# Altium schematic sheet Copy of USB.SchDoc: USB
size A4; DocumentNumber: MB1137; Revision: B-01; SheetNumber: 4; SheetTotal: 6; Project: NUCLEO-XXXXZX
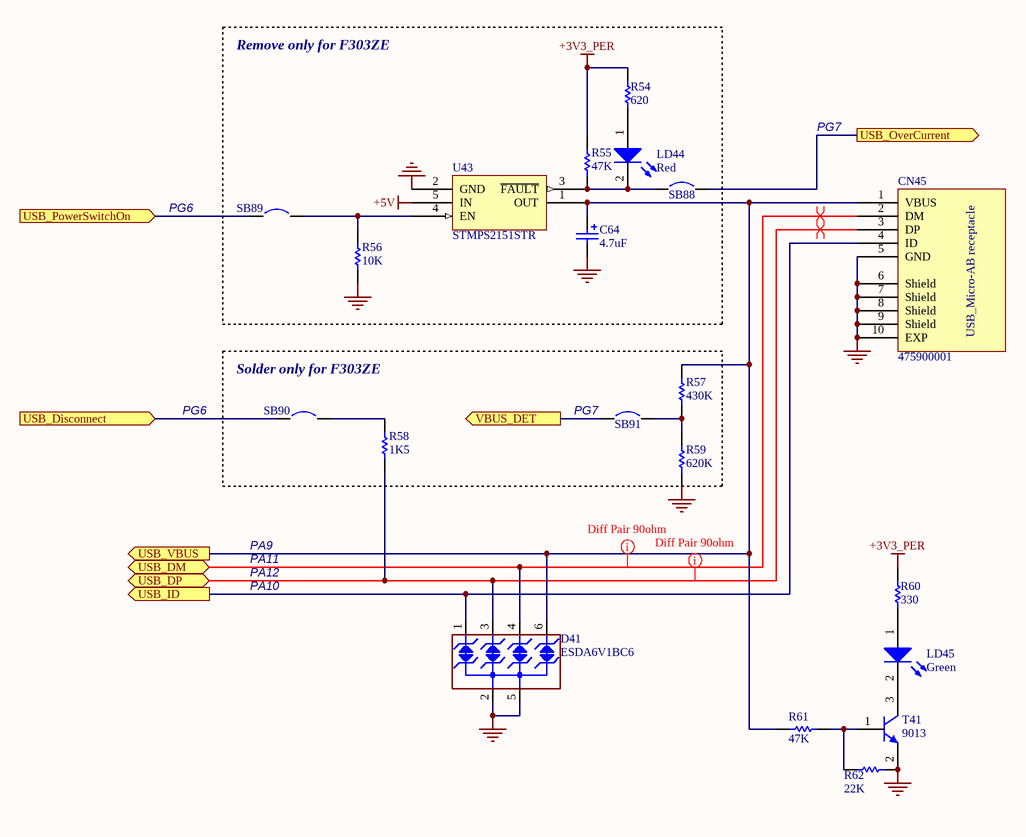
[diagram p0: Copy of USB.SchDoc]

## Parts
C64  4.7uF  [TAN-A]
CN45  475900001  [MOLEX_47590001]
D41  ESDA6V1BC6  [SOT23-6L]
LD44  Red  [0603D-R]
LD45  Green  [0603D-G]
R54  620  [0603R]
R55  47K  [0603R]
R56  10K  [0603R]
R57  430K  [0603R]
R58  1K5  [0603R]
R59  620K  [0603R]
R60  330  [0603R]
R61  47K  [0603R]
R62  22K  [0603R]
SB88  Circuit Breaker  [SB_0603]  (value not drawn)
SB89  Circuit Breaker  [SB_0603]  (value not drawn)
SB90  Circuit Breaker  [SB_0603]  (value not drawn)
SB91  Circuit Breaker  [SB_0603]  (value not drawn)
T41  9013  [SOT-23]
U43  STMPS2151STR  [SOT-23-5L]

## Blocks framed on the sheet
Remove only for F303ZE: C64 LD44 R54-R56 SB88 SB89 U43
Solder only for F303ZE: R57-R59 SB90 SB91

## Ports
USB_Disconnect (in), USB_DM (bidir), USB_DP (bidir), USB_ID (out), USB_OverCurrent (out), USB_PowerSwitchOn (in), USB_VBUS (out), VBUS_DET (out)

## Nets
+3V3_PER: R54.2 R55.1 R60.2
+5V: U43.5(IN)
GND: C64.2 CN45.5(GND) CN45.6(Shield) CN45.7(Shield) CN45.8(Shield) CN45.9(Shield) CN45.10(EXP) D41.2(IO2) D41.5(IO4) R56.1 R59.2 R62.1 T41.2(E) U43.2(GND)
USB_Disconnect: SB90.1 ; port USB_Disconnect
USB_DM: CN45.2(DM) D41.4(IO3) ; port USB_DM
USB_DP: CN45.3(DP) D41.3(GND) R58.1 ; port USB_DP
USB_ID: CN45.4(ID) D41.1(IO1) ; port USB_ID
USB_OverCurrent: SB88.2 ; port USB_OverCurrent
USB_PowerSwitchOn: SB89.1 ; port USB_PowerSwitchOn
USB_VBUS: C64.1 CN45.1(VBUS) D41.6(NC) R57.1 R61.1 U43.1(OUT) ; port USB_VBUS
VBUS_DET: SB91.1 ; port VBUS_DET
NetLD44_1: LD44.1(A) R54.1
NetLD44_2: LD44.2(K) R55.2 SB88.1 U43.3(~{FAULT})
NetLD45_1: LD45.1(A) R60.1
NetLD45_2: LD45.2(K) T41.3(C)
NetR56_2: R56.2 SB89.2 U43.4(EN)
NetR57_2: R57.2 R59.1 SB91.2
NetR58_2: R58.2 SB90.2
NetR61_2: R61.2 R62.2 T41.1(B)

## Layout directives
mark named Diff Pair 90ohm: USB_DM, USB_DP
differential pair: USB_DM, USB_DP

## Notes on the sheet
- PG7
- PG6
- (near SB91) PG7
- PA9
- PA12
- PA11
- PA10
- Title:
- Project:
- Size:
- Date:
- A4
- Reference:
- Sheet:
- Revision:
- of
- (in symbol 475900001) USB_Micro-AB receptacle

## Library data of the parts
C64 = Cap Pol1: Polarized Capacitor (Radial); Value: 47uF; Published: 8-Jun-2000; Revision: July-2002: Re-released for DXP Platform.; Publisher: Altium Limited
D41 = ESDA6V1BC6: 4-line ESD protection; Manuf_1: STM; Manuf_Part_1: ESDA5V3L; Ref St: 9179034; Provided: ST; ECCN_US/EU: EAR99/NEC; Distrib: ST; Order: ESDA5V3L; Ordered by: STM
LD44 LD45 = LED2: Typical RED, GREEN, YELLOW, AMBER GaAs LED; Published: 8-Jun-2000; Revision: July-2002: Re-released for DXP Platform.; Publisher: Altium Limited
R54 R56 = Res1: Resistor; Value: 1K; Published: 8-Jun-2000; Revision: July-2002: Re-released for DXP Platform.; Publisher: Altium Limited
R55 R57 R59-R62 = res1: Resistor; Value: 1K; Published: 8-Jun-2000; Revision: July-2002: Re-released for DXP Platform.; Publisher: Altium Limited
R58 = Resistor_ST: Resistor 0402 / 0603 / 0805; Value: 10K
SB88-SB91 = Circuit Breaker: Solder: NO; Published: 24-Mar-1999; Revision: July-2002: Re-released for DXP Platform.; Publisher: Altium Limited
T41 = NPN: NPN Bipolar Transistor; Code - JEDEC: TO-226-AA; Published: 8-Jun-2000; Revision: July-2002: Re-released for DXP Platform.; Publisher: Altium Limited
U43 = STMPS2141STR